# Altium project ui-v1.3.PrjPcb
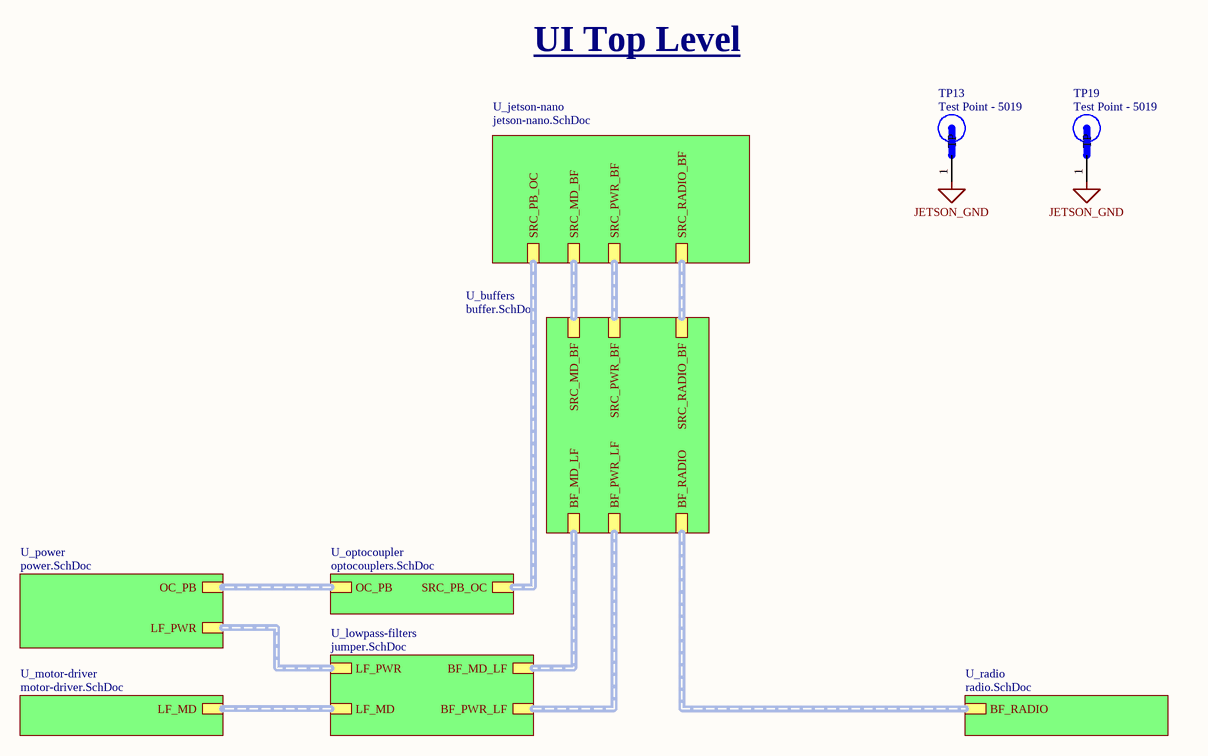
[diagram p0: ui-pcb.SchDoc]
8 sheets, 83 parts. Net scope: hierarchical (ports join the sheet entries above them; power ports are global).
Board file: ui_layout-v1.3.PcbDoc
Sheets:
  ui-pcb.SchDoc
    U_jetson-nano = jetson-nano.SchDoc
    U_lowpass-filters = jumper.SchDoc
    U_radio = radio.SchDoc
    U_motor-driver = motor-driver.SchDoc
    U_power = power.SchDoc
    U_buffers = buffer.SchDoc
    U_optocoupler = optocouplers.SchDoc

## Sheet ui-pcb.SchDoc
size A4; SheetNumber: 1; SheetTotal: 8

### Parts
TP13  Test Point - 5019  [TP380X203]
TP19  Test Point - 5019  [TP380X203]

### Sub-sheets
U_buffers = buffer.SchDoc: SRC_MD_BF (harness MD_SIGNALS), SRC_PWR_BF (harness PWR_SIGNALS), SRC_RADIO_BF (harness DS_SIGNALS), BF_MD_LF (harness MD_SIGNALS), BF_PWR_LF (harness PWR_SIGNALS), BF_RADIO (harness DS_SIGNALS)
U_jetson-nano = jetson-nano.SchDoc: SRC_RADIO_BF (harness DS_SIGNALS), SRC_PWR_BF (harness PWR_SIGNALS), SRC_MD_BF (harness MD_SIGNALS), SRC_PB_OC (harness PB_SIGNALS)
U_lowpass-filters = jumper.SchDoc: BF_PWR_LF (harness PWR_SIGNALS), LF_PWR (harness PWR_SIGNALS), BF_MD_LF (harness MD_SIGNALS), LF_MD (harness MD_SIGNALS)
U_motor-driver = motor-driver.SchDoc: LF_MD (harness MD_SIGNALS)
U_optocoupler = optocouplers.SchDoc: OC_PB (harness PB_SIGNALS), SRC_PB_OC (harness PB_SIGNALS)
U_power = power.SchDoc: LF_PWR (harness PWR_SIGNALS), OC_PB (harness PB_SIGNALS)
U_radio = radio.SchDoc: BF_RADIO (harness DS_SIGNALS)

### Nets
JETSON_GND: TP13.1(TP) TP19.1(TP)

### Buses and harness runs
harness sheet U_buffers/BF_MD_LF = sheet U_lowpass-filters/BF_MD_LF
harness sheet U_buffers/BF_PWR_LF = sheet U_lowpass-filters/BF_PWR_LF
harness sheet U_buffers/BF_RADIO = sheet U_radio/BF_RADIO
harness sheet U_buffers/SRC_MD_BF = sheet U_jetson-nano/SRC_MD_BF
harness sheet U_buffers/SRC_PWR_BF = sheet U_jetson-nano/SRC_PWR_BF
harness sheet U_buffers/SRC_RADIO_BF = sheet U_jetson-nano/SRC_RADIO_BF
harness sheet U_jetson-nano/SRC_PB_OC = sheet U_optocoupler/SRC_PB_OC
harness sheet U_lowpass-filters/LF_MD = sheet U_motor-driver/LF_MD
harness sheet U_lowpass-filters/LF_PWR = sheet U_power/LF_PWR
harness sheet U_optocoupler/OC_PB = sheet U_power/OC_PB

### Notes on the sheet
- UI Top Level

### Library data of the parts
TP13 TP19 = Test Point - 5019: PC Test Point, Miniature Phosphor Bronze, Silver Plating Surface Mount Mounting Type; MP: 5019; MF: Keystone Electronics; Value: *; Package: 2010 Keystone; Part Number: Test Point - 5019

## Sheet jetson-nano.SchDoc
size A3
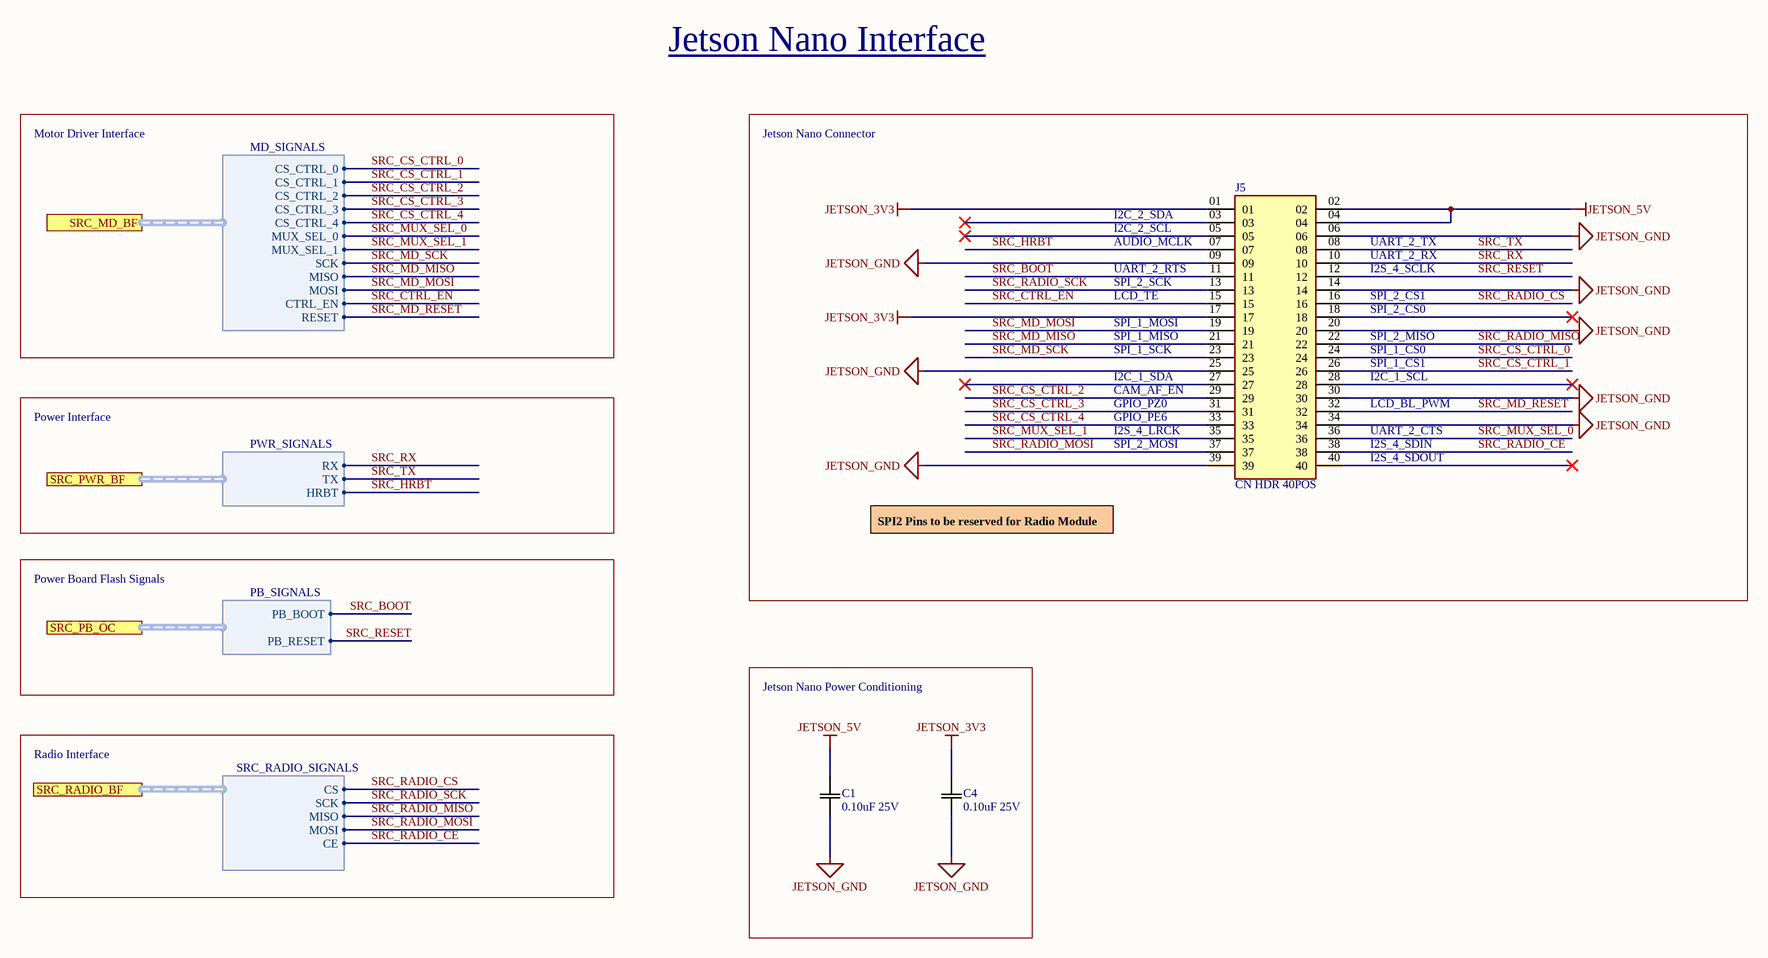
[diagram p1: jetson-nano.SchDoc]

### Parts
C1  0.10uF 25V  [0805]
C4  0.10uF 25V  [0805]
J5  CN HDR 40POS  [CN HDR 40POS 0.1 TH]

### Blocks framed on the sheet
Jetson Nano Power Conditioning: C1 C4

### Ports
SRC_MD_BF (harness MD_SIGNALS), SRC_PB_OC (harness PB_SIGNALS), SRC_PWR_BF (harness PWR_SIGNALS), SRC_RADIO_BF (harness SRC_RADIO_SIGNALS)

### Harnesses
PWR_SIGNALS: TX, RX, HRBT
MD_SIGNALS: CS_CTRL_0, MUX_SEL_1, SCK, MOSI, MISO, CS_CTRL_1, CS_CTRL_2, CS_CTRL_3, CS_CTRL_4, MUX_SEL_0, CTRL_EN, RESET
PB_SIGNALS: PB_BOOT, PB_RESET
SRC_RADIO_SIGNALS: SCK, MOSI, MISO, CS, CE

### Nets
JETSON_3V3: C4.2(C2) J5.01 J5.17
JETSON_5V: C1.2(C2) J5.02 J5.04
JETSON_GND: C1.1(C1) C4.1(C1) J5.06 J5.09 J5.14 J5.20 J5.25 J5.30 J5.34 J5.39
SRC_BOOT: J5.11 ; port SRC_PB_OC.PB_BOOT
SRC_CS_CTRL_0: J5.24 ; port SRC_MD_BF.CS_CTRL_0
SRC_CS_CTRL_1: J5.26 ; port SRC_MD_BF.CS_CTRL_1
SRC_CS_CTRL_2: J5.29 ; port SRC_MD_BF.CS_CTRL_2
SRC_CS_CTRL_3: J5.31 ; port SRC_MD_BF.CS_CTRL_3
SRC_CS_CTRL_4: J5.33 ; port SRC_MD_BF.CS_CTRL_4
SRC_CTRL_EN: J5.15 ; port SRC_MD_BF.CTRL_EN
SRC_HRBT: J5.07 ; port SRC_PWR_BF.HRBT
SRC_MD_MISO: J5.21 ; port SRC_MD_BF.MISO
SRC_MD_MOSI: J5.19 ; port SRC_MD_BF.MOSI
SRC_MD_RESET: J5.32 ; port SRC_MD_BF.RESET
SRC_MD_SCK: J5.23 ; port SRC_MD_BF.SCK
SRC_MUX_SEL_0: J5.36 ; port SRC_MD_BF.MUX_SEL_0
SRC_MUX_SEL_1: J5.35 ; port SRC_MD_BF.MUX_SEL_1
SRC_RADIO_CE: J5.38 ; port SRC_RADIO_BF.CE
SRC_RADIO_CS: J5.16 ; port SRC_RADIO_BF.CS
SRC_RADIO_MISO: J5.22 ; port SRC_RADIO_BF.MISO
SRC_RADIO_MOSI: J5.37 ; port SRC_RADIO_BF.MOSI
SRC_RADIO_SCK: J5.13 ; port SRC_RADIO_BF.SCK
SRC_RESET: J5.12 ; port SRC_PB_OC.PB_RESET
SRC_RX: J5.10 ; port SRC_PWR_BF.RX
SRC_TX: J5.08 ; port SRC_PWR_BF.TX

Not connected (* = marked no-connect by the designer): J5 03* 05* 18* 27* 28* 40*

### Notes on the sheet
- Jetson Nano Interface
- Motor Driver Interface
- Jetson Nano Connector
- AUDIO_MCLK
- UART_2_RTS
- I2C_2_SDA
- I2C_2_SCL
- I2S_4_SCLK
- UART_2_TX
- UART_2_RX
- LCD_TE
- SPI_2_SCK
- SPI_1_MOSI
- SPI_1_MISO
- SPI_2_CS1
- SPI_2_MISO
- SPI_2_CS0
- GPIO_PZ0
- CAM_AF_EN
- SPI_1_SCK
- I2C_1_SDA
- LCD_BL_PWM
- SPI_1_CS0
- SPI_1_CS1
- I2C_1_SCL
- Power Interface
- SPI_2_MOSI
- I2S_4_LRCK
- GPIO_PE6
- I2S_4_SDIN
- UART_2_CTS
- I2S_4_SDOUT
- SPI2 Pins to be reserved for Radio Module
- Power Board Flash Signals
- Radio Interface

### Library data of the parts
C1 C4 = CAP 0.10uF 25V: CAP CER 0.10UF 25V X7R 0805; Value: 0.1uF; Tolerance: 10%; Temperature Coefficient: X7R; Rating: 25V; Part Number: CAP 0.10uF 25V; Operating Temperature: -55°C ~ 125°C
J5 = CN HDR 40POS: 40 Position Header Connector; Part Number: CN HDR 40POS; Supplier 1: Digi-Key; Supplier Part Number 1: S6104-ND; Supplier URL 1: https://www.digikey.ca/en/products/detail/sullins-connector-solutions/PPTC202LFBN-RC/807240?s=N4IgTCBcDaIMoDYCMAGALAWgHIBEQF0BfIA; Pin Count: 40

## Sheet jumper.SchDoc
size A3; SheetNumber: 1; SheetTotal: 6
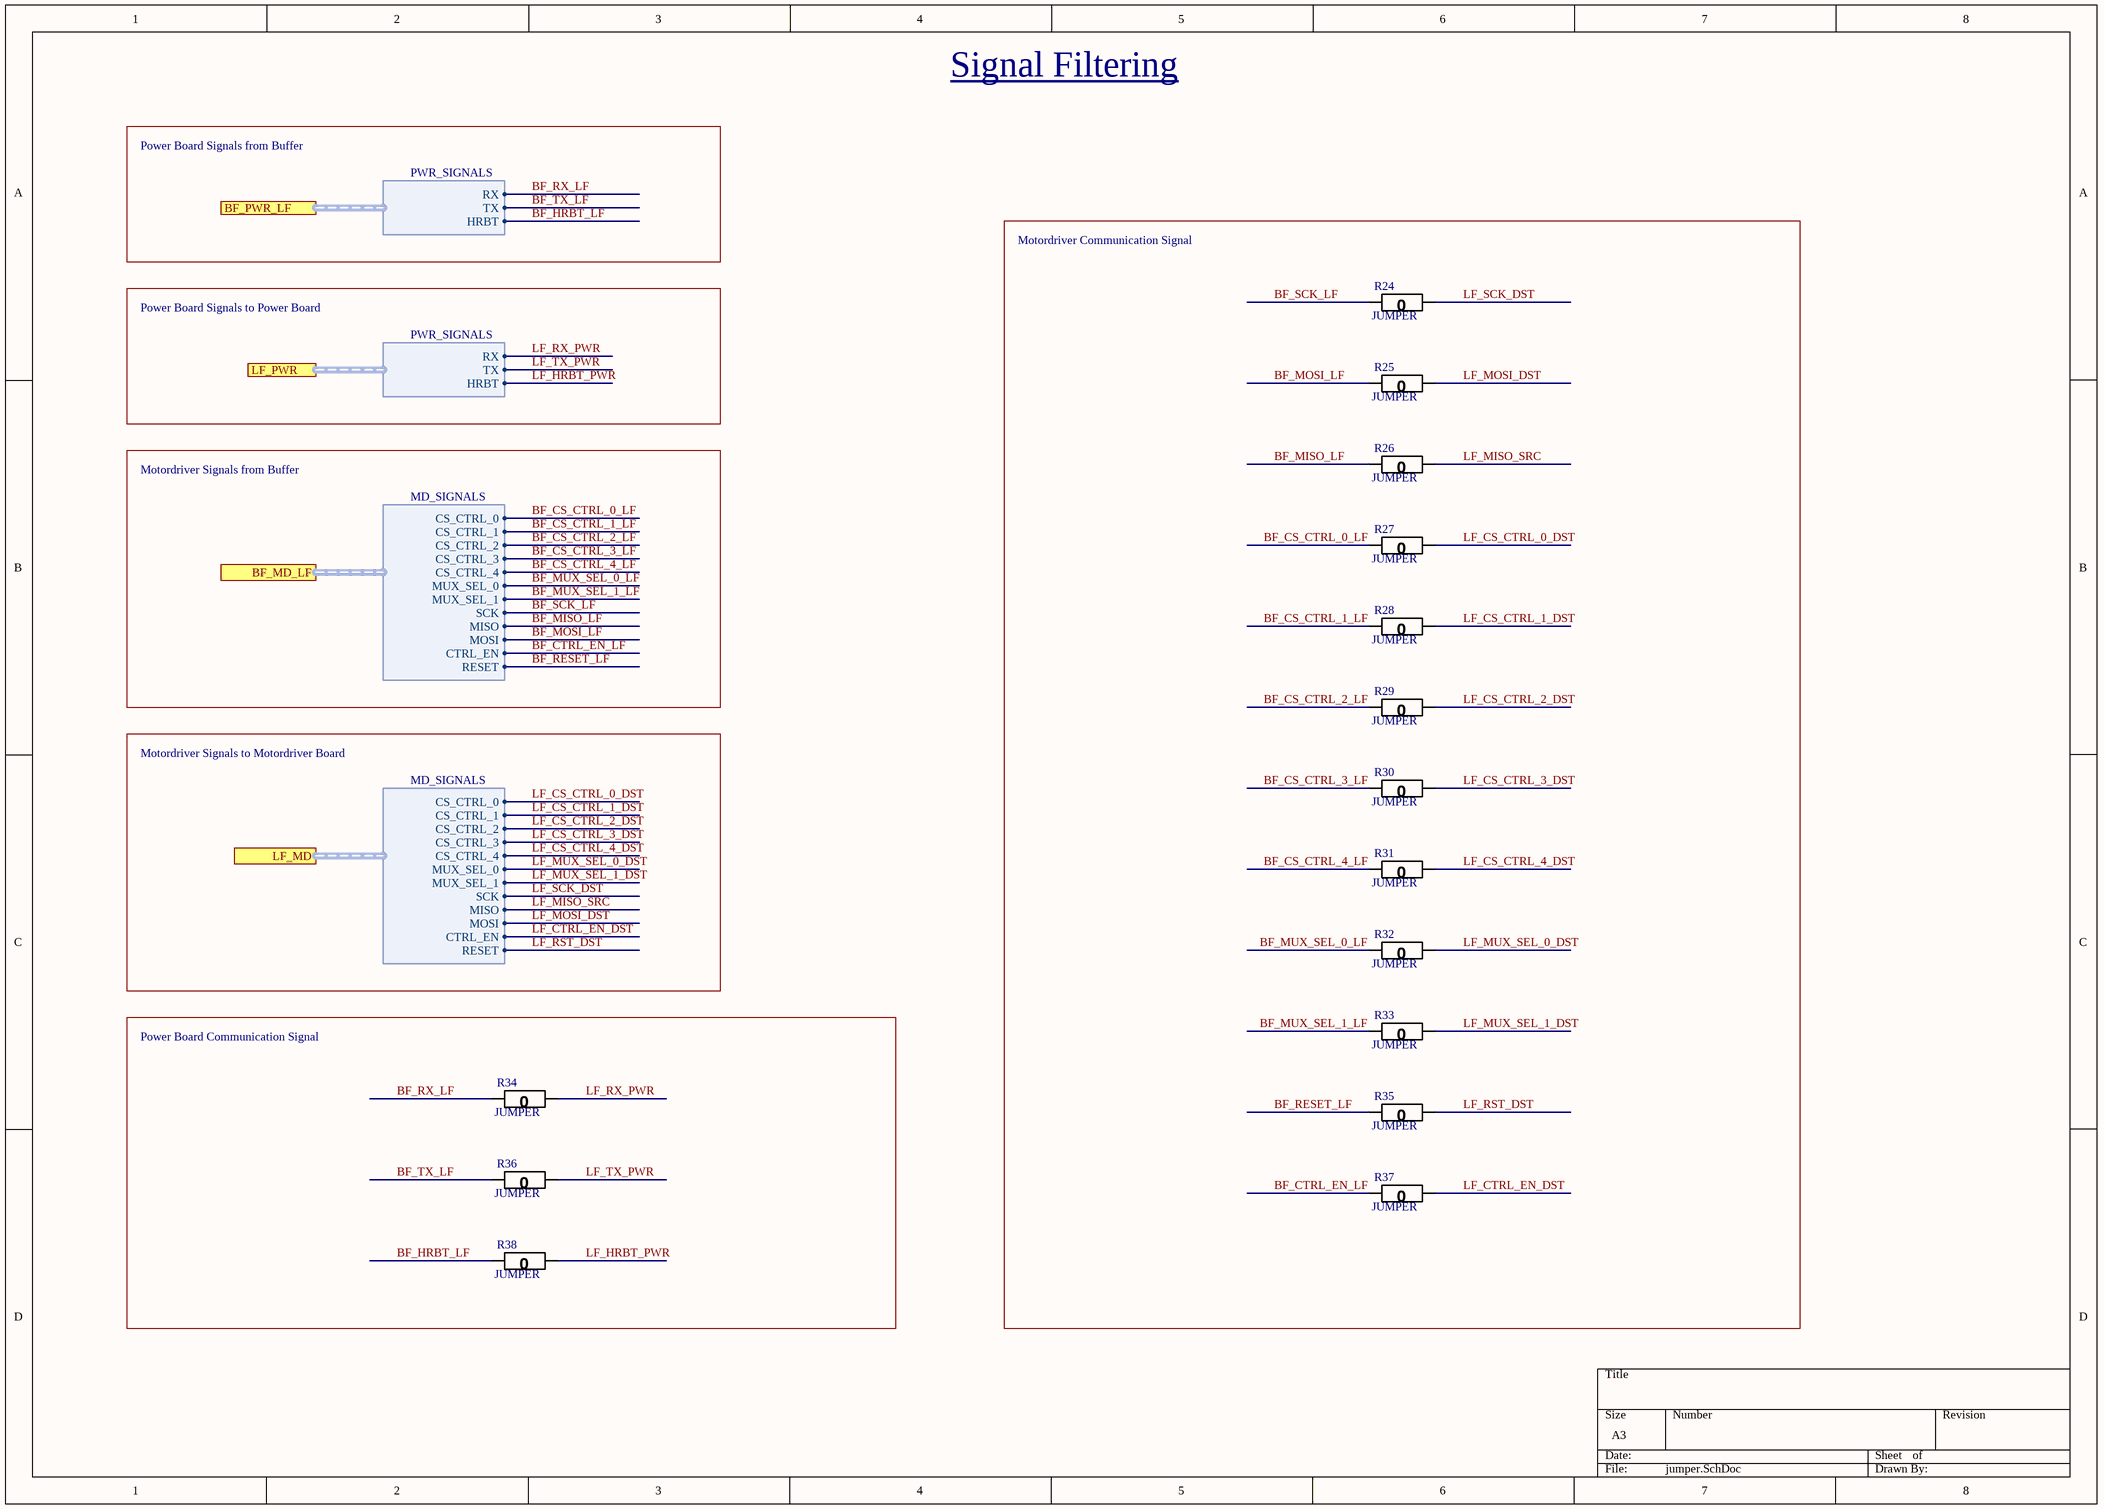
[diagram p2: jumper.SchDoc]

### Parts
R24  JUMPER  [0603]
R25  JUMPER  [0603]
R26  JUMPER  [0603]
R27  JUMPER  [0603]
R28  JUMPER  [0603]
R29  JUMPER  [0603]
R30  JUMPER  [0603]
R31  JUMPER  [0603]
R32  JUMPER  [0603]
R33  JUMPER  [0603]
R34  JUMPER  [0603]
R35  JUMPER  [0603]
R36  JUMPER  [0603]
R37  JUMPER  [0603]
R38  JUMPER  [0603]

### Blocks framed on the sheet
Motordriver Communication Signal: R24-R33 R35 R37
Power Board Communication Signal: R34 R36 R38

### Ports
BF_MD_LF (harness MD_SIGNALS), BF_PWR_LF (harness PWR_SIGNALS), LF_MD (harness MD_SIGNALS), LF_PWR (harness PWR_SIGNALS)

### Harnesses
PWR_SIGNALS: TX, RX, HRBT
MD_SIGNALS: CS_CTRL_0, MUX_SEL_1, SCK, MOSI, MISO, CS_CTRL_1, CS_CTRL_2, CS_CTRL_3, CS_CTRL_4, MUX_SEL_0, CTRL_EN, RESET

### Nets
BF_CS_CTRL_0_LF: R27.2(R2) ; port BF_MD_LF.CS_CTRL_0  [project net BF_CS_CTRL_0]
BF_CS_CTRL_1_LF: R28.2(R2) ; port BF_MD_LF.CS_CTRL_1  [project net BF_CS_CTRL_1]
BF_CS_CTRL_2_LF: R29.2(R2) ; port BF_MD_LF.CS_CTRL_2  [project net BF_CS_CTRL_2]
BF_CS_CTRL_3_LF: R30.2(R2) ; port BF_MD_LF.CS_CTRL_3  [project net BF_CS_CTRL_3]
BF_CS_CTRL_4_LF: R31.2(R2) ; port BF_MD_LF.CS_CTRL_4  [project net BF_CS_CTRL_4]
BF_CTRL_EN_LF: R37.2(R2) ; port BF_MD_LF.CTRL_EN  [project net BF_CTRL_EN]
BF_HRBT_LF: R38.2(R2) ; port BF_PWR_LF.HRBT  [project net BF_HRBT]
BF_MISO_LF: R26.2(R2) ; port BF_MD_LF.MISO  [project net BF_MISO]
BF_MOSI_LF: R25.2(R2) ; port BF_MD_LF.MOSI  [project net BF_MOSI]
BF_MUX_SEL_0_LF: R32.2(R2) ; port BF_MD_LF.MUX_SEL_0  [project net BF_MUX_SEL_0]
BF_MUX_SEL_1_LF: R33.2(R2) ; port BF_MD_LF.MUX_SEL_1  [project net BF_MUX_SEL_1]
BF_RESET_LF: R35.2(R2) ; port BF_MD_LF.RESET  [project net BF_RESET]
BF_RX_LF: R34.2(R2) ; port BF_PWR_LF.RX  [project net BF_RX]
BF_SCK_LF: R24.2(R2) ; port BF_MD_LF.SCK  [project net BF_SCK]
BF_TX_LF: R36.2(R2) ; port BF_PWR_LF.TX  [project net BF_TX]
LF_CS_CTRL_0_DST: R27.1(R1) ; port LF_MD.CS_CTRL_0  [project net CS_CTRL_0]
LF_CS_CTRL_1_DST: R28.1(R1) ; port LF_MD.CS_CTRL_1  [project net CS_CTRL_1]
LF_CS_CTRL_2_DST: R29.1(R1) ; port LF_MD.CS_CTRL_2  [project net CS_CTRL_2]
LF_CS_CTRL_3_DST: R30.1(R1) ; port LF_MD.CS_CTRL_3  [project net CS_CTRL_3]
LF_CS_CTRL_4_DST: R31.1(R1) ; port LF_MD.CS_CTRL_4  [project net CS_CTRL_4]
LF_CTRL_EN_DST: R37.1(R1) ; port LF_MD.CTRL_EN  [project net CTRL_EN]
LF_HRBT_PWR: R38.1(R1) ; port LF_PWR.HRBT  [project net HRBT]
LF_MISO_SRC: R26.1(R1) ; port LF_MD.MISO
LF_MOSI_DST: R25.1(R1) ; port LF_MD.MOSI
LF_MUX_SEL_0_DST: R32.1(R1) ; port LF_MD.MUX_SEL_0
LF_MUX_SEL_1_DST: R33.1(R1) ; port LF_MD.MUX_SEL_1
LF_RST_DST: R35.1(R1) ; port LF_MD.RESET
LF_RX_PWR: R34.1(R1) ; port LF_PWR.RX
LF_SCK_DST: R24.1(R1) ; port LF_MD.SCK
LF_TX_PWR: R36.1(R1) ; port LF_PWR.TX

### Notes on the sheet
- Signal Filtering
- Power Board Signals from Buffer
- Power Board Signals to Power Board
- Motordriver Signals from Buffer
- Motordriver Signals to Motordriver Board

### Library data of the parts
R24-R38 = RES 0 JUMPER: RES SMD 0 OHM JUMPER GENERIC 0603; Manufacturer Part Number 1: RK73Z1JTTD; Value: 0; Package: 0805; Part Number: RES 0 JUMPER; Tolerance: N/A; Supplier 1: Digi-Key; Supplier Part Number 1: 2019-RK73Z1JTTDCT-ND; Supplier URL 1: https://www.digikey.ca/en/products/detail/koa-speer-electronics-inc/RK73Z1JTTD/9845478

## Sheet radio.SchDoc
size A4; SheetNumber: 8; SheetTotal: 8
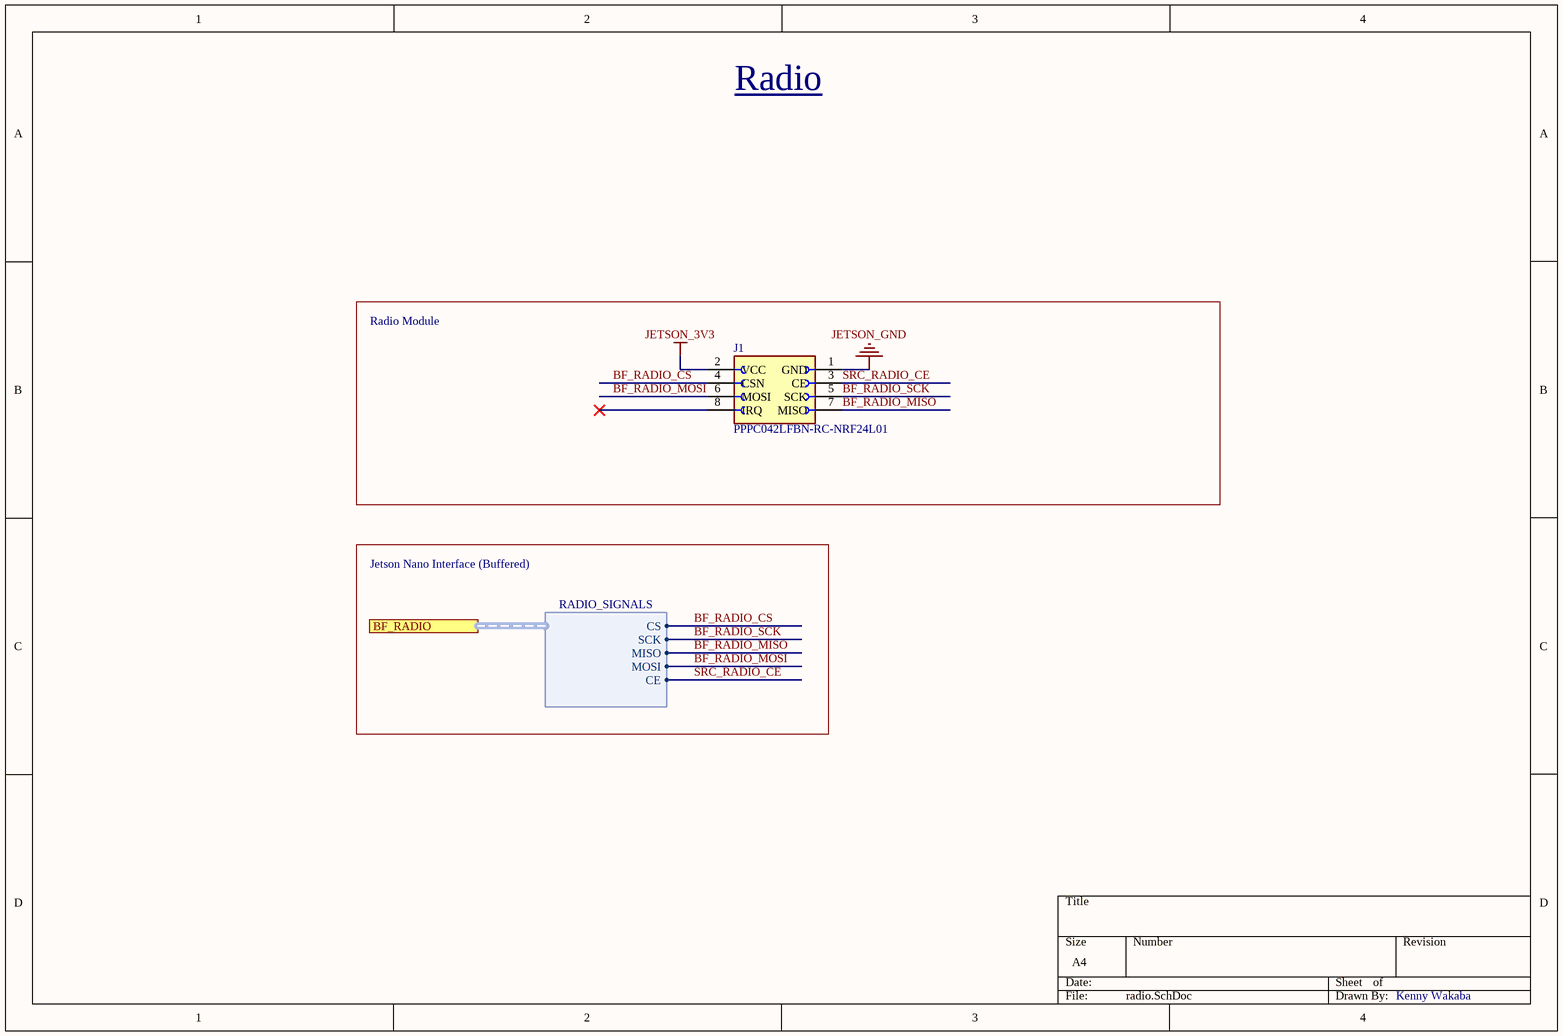
[diagram p3: radio.SchDoc]

### Parts
J1  PPPC042LFBN-RC-NRF24L01  [PPPC042LFBN-RC-NRF24L01]

### Blocks framed on the sheet
Radio Module: J1

### Ports
BF_RADIO (harness RADIO_SIGNALS)

### Harnesses
RADIO_SIGNALS: SCK, MOSI, MISO, CS, CE

### Nets
JETSON_3V3: J1.2(VCC)
JETSON_GND: J1.1(GND)
BF_RADIO_CS: J1.4(CSN) ; port BF_RADIO.CS
BF_RADIO_MISO: J1.7(MISO) ; port BF_RADIO.MISO
BF_RADIO_MOSI: J1.6(MOSI) ; port BF_RADIO.MOSI
BF_RADIO_SCK: J1.5(SCK) ; port BF_RADIO.SCK
SRC_RADIO_CE: J1.3(CE) ; port BF_RADIO.CE  [project net BF_RADIO_CE]

Not connected (* = marked no-connect by the designer): J1 8(IRQ)*

### Notes on the sheet
- Radio
- Jetson Nano Interface (Buffered)
- Kenny Wakaba

### Library data of the parts
J1 = CN PPPC042LFBN-RC-NRF24L01: 8 Position Header Connector 0.100 (2.54mm) Through Hole Gold; MF: Sullins Connector Solutions; SnapEDA_Link: https://www.snapeda.com/parts/PPPC042LFBN-RC/Sullins+Connector+Solutions/view-part/?ref=snap; Package: None; Purchase-URL: https://pricing.snapeda.com/search/part/PPPC042LFBN-RC/?ref=eda; Price: None; Value: *; Check_prices: https://www.snapeda.com/parts/PPPC042LFBN-RC/Sullins+Connector+Solutions/view-part/?ref=eda; MP: PPPC042LFBN-RC; Availability: In Stock; Part Number: CN PPPC042LFBN-RC-NRF24L01; Manufacturer Part Number 1: PPPC042LFBN-RC; Supplier 1: Digi-Key; Supplier Part Number 1: S7107-ND; Supplier URL 1: https://www.digikey.ca/en/products/detail/sullins-connector-solutions/PPPC042LFBN-RC/810244?utm_adgroup=Rectangular%20Connectors%20-%20Headers%2C%20Receptacles%2C%20Female%20Sockets&utm_source=google&utm_medium=cpc&utm_campaign=Shopping_Product_Connectors; Pin Count: 8

## Sheet motor-driver.SchDoc
size A
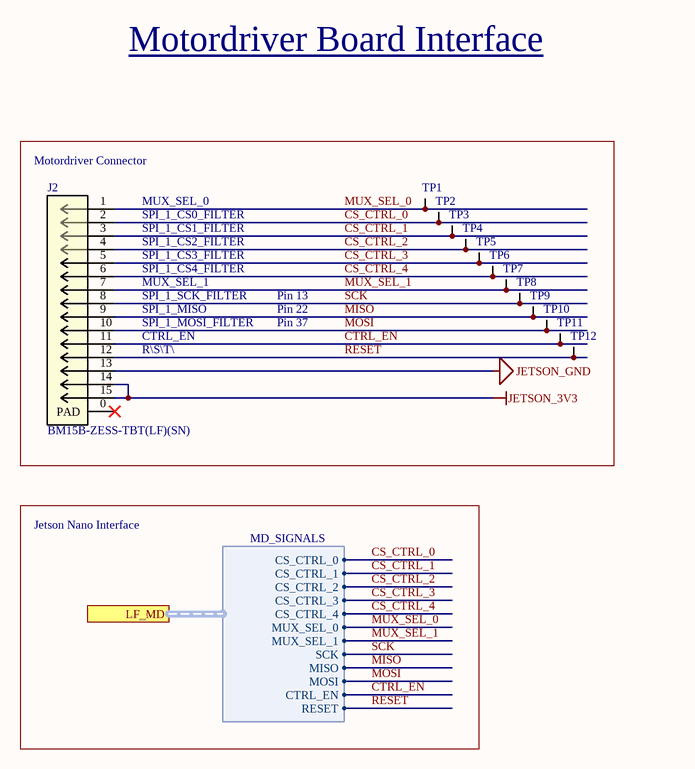
[diagram p4: motor-driver.SchDoc]

### Parts
J2  BM15B-ZESS-TBT(LF)(SN)  [JST ZE SMT 15POS]
TP1  Test Point (Via)  [TP]  (value not drawn)  (no BOM)
TP2  Test Point (Via)  [TP]  (value not drawn)  (no BOM)
TP3  Test Point (Via)  [TP]  (value not drawn)  (no BOM)
TP4  Test Point (Via)  [TP]  (value not drawn)  (no BOM)
TP5  Test Point (Via)  [TP]  (value not drawn)  (no BOM)
TP6  Test Point (Via)  [TP]  (value not drawn)  (no BOM)
TP7  Test Point (Via)  [TP]  (value not drawn)  (no BOM)
TP8  Test Point (Via)  [TP]  (value not drawn)  (no BOM)
TP9  Test Point (Via)  [TP]  (value not drawn)  (no BOM)
TP10  Test Point (Via)  [TP]  (value not drawn)  (no BOM)
TP11  Test Point (Via)  [TP]  (value not drawn)  (no BOM)
TP12  Test Point (Via)  [TP]  (value not drawn)  (no BOM)

### Ports
LF_MD (harness MD_SIGNALS)

### Harnesses
MD_SIGNALS: CS_CTRL_0, MUX_SEL_1, SCK, MOSI, MISO, CS_CTRL_1, CS_CTRL_2, CS_CTRL_3, CS_CTRL_4, MUX_SEL_0, CTRL_EN, RESET

### Nets
JETSON_3V3: J2.14 J2.15
JETSON_GND: J2.13
CS_CTRL_0: J2.2 TP2.1 ; port LF_MD.CS_CTRL_0
CS_CTRL_1: J2.3 TP3.1 ; port LF_MD.CS_CTRL_1
CS_CTRL_2: J2.4 TP4.1 ; port LF_MD.CS_CTRL_2
CS_CTRL_3: J2.5 TP5.1 ; port LF_MD.CS_CTRL_3
CS_CTRL_4: J2.6 TP6.1 ; port LF_MD.CS_CTRL_4
CTRL_EN: J2.11 TP11.1 ; port LF_MD.CTRL_EN
MISO: J2.9 TP9.1 ; port LF_MD.MISO  [project net LF_MISO_SRC]
MOSI: J2.10 TP10.1 ; port LF_MD.MOSI  [project net LF_MOSI_DST]
MUX_SEL_0: J2.1 TP1.1 ; port LF_MD.MUX_SEL_0  [project net LF_MUX_SEL_0_DST]
MUX_SEL_1: J2.7 TP7.1 ; port LF_MD.MUX_SEL_1  [project net LF_MUX_SEL_1_DST]
RESET: J2.12 TP12.1 ; port LF_MD.RESET  [project net LF_RST_DST]
SCK: J2.8 TP8.1 ; port LF_MD.SCK  [project net LF_SCK_DST]

Not connected (* = marked no-connect by the designer): J2 0(PAD)*

### Notes on the sheet
- Motordriver Board Interface
- (near J2) Motordriver Connector
- MUX_SEL_0
- SPI_1_CS0_FILTER
- SPI_1_CS1_FILTER
- SPI_1_CS2_FILTER
- SPI_1_CS3_FILTER
- SPI_1_CS4_FILTER
- CTRL_EN
- SPI_1_SCK_FILTER
- SPI_1_MISO
- SPI_1_MOSI_FILTER
- MUX_SEL_1
- Pin 37
- Pin 22
- Pin 13
- R\S\T\
- Jetson Nano Interface

### Library data of the parts
J2 = CN 15POS JST ZE SMT: CONN HEADER VERT SMD 15POS ZE; Supplier 1: Digi-Key; Supplier Part Number 1: 455-4211-1-ND; Part Number: CN 15POS JST ZE SMT; Manufacturer Part Number 1: BM15B-ZESS-TBT(LF)(SN); Supplier URL 1: https://www.digikey.ca/en/products/detail/jst-sales-america-inc/BM15B-ZESS-TBT-LF-SN/1886999?s=N4IgTCBcDaIEIFkCMBWOBaAWgUQMq-QBU5CAKAGQDEBKU3AOWpAF0BfIA; Pin Count: 15
TP1-TP12 = Test Point (Via): Part Number: Test Point (Via)

## Sheet power.SchDoc
size A4; SheetNumber: 3; SheetTotal: 4
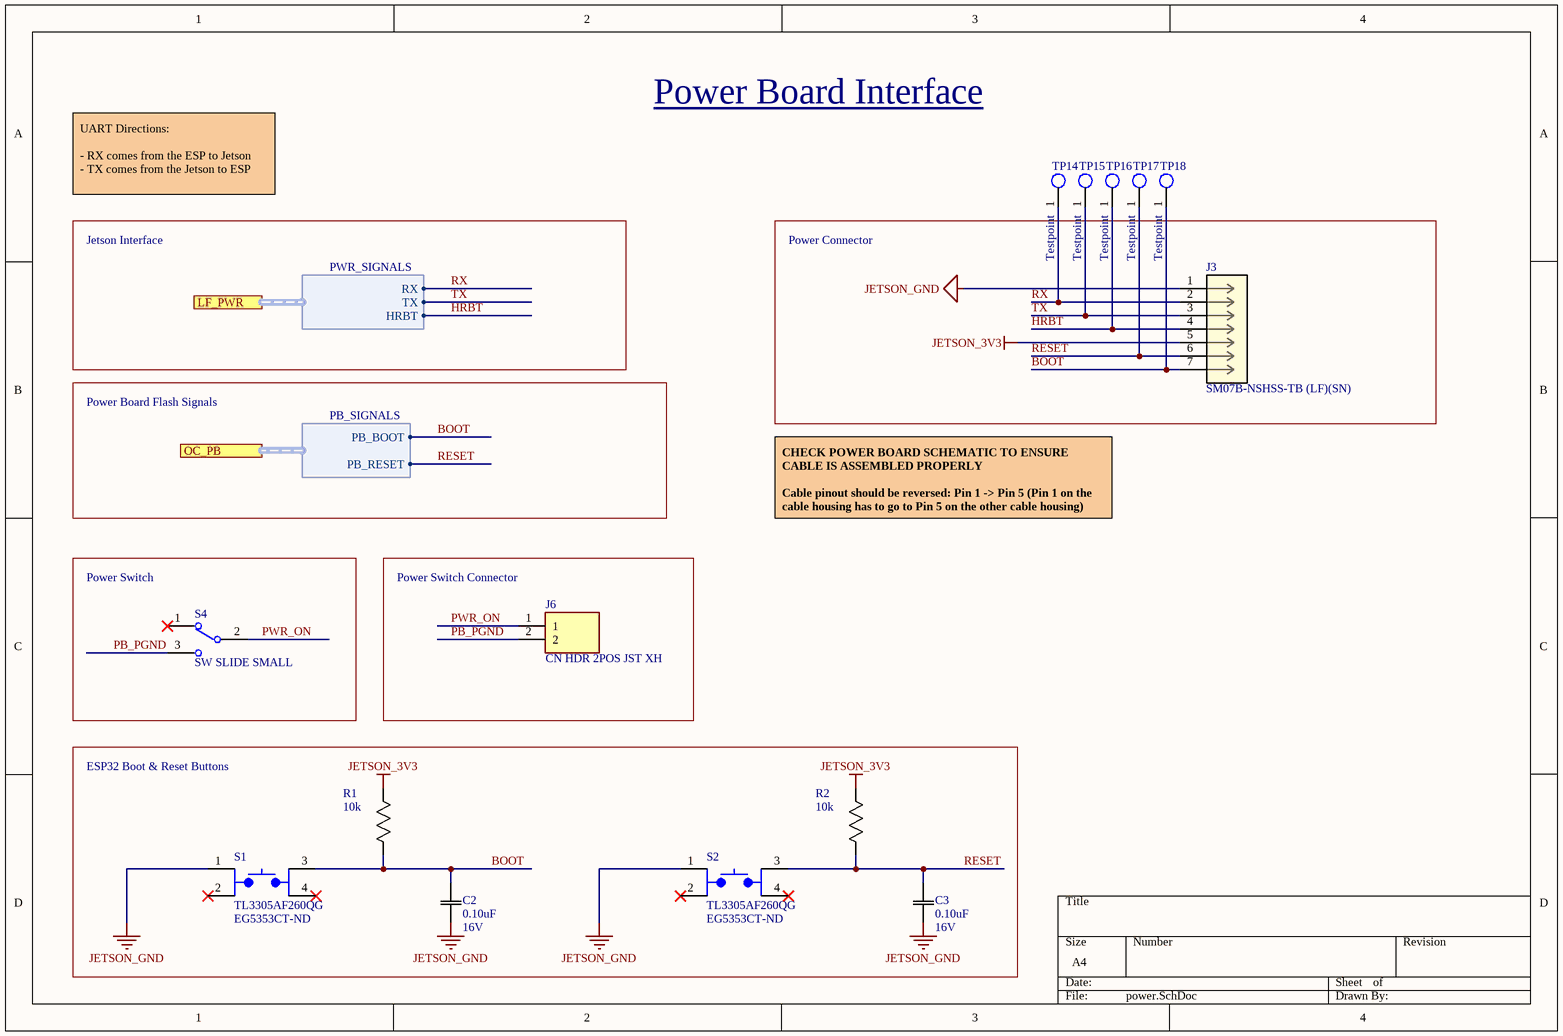
[diagram p5: power.SchDoc]

### Parts
C2  Rating: 16V  [0603]  (hidden comment: 0.10uF)
C3  Rating: 16V  [0603]  (hidden comment: 0.10uF)
J3  SM07B-NSHSS-TB (LF)(SN)  [JST_SM07B-NSHSS-TB_(LF)(SN)]
J6  CN HDR 2POS JST XH  [JST_B2B-XH-A(LF)(SN)]
R1  10k  [0603]
R2  10k  [0603]
S1  TL3305AF260QG  Supplier Part Number 1: EG5353CT-ND  [SW_TL3305AF260QG]
S2  TL3305AF260QG  Supplier Part Number 1: EG5353CT-ND  [SW_TL3305AF260QG]
S4  SW SLIDE SMALL  [SW SLIDE SMALL]
TP14  Testpoint  [TP_1mm]
TP15  Testpoint  [TP_1mm]
TP16  Testpoint  [TP_1mm]
TP17  Testpoint  [TP_1mm]
TP18  Testpoint  [TP_1mm]

### Blocks framed on the sheet
Power Connector: J3
Power Switch: S4
Power Switch Connector: J6
ESP32 Boot & Reset Buttons: C2 C3 R1 R2 S1 S2

### Ports
LF_PWR (harness PWR_SIGNALS), OC_PB (harness PB_SIGNALS)

### Harnesses
PWR_SIGNALS: TX, RX, HRBT
PB_SIGNALS: PB_BOOT, PB_RESET

### Nets
JETSON_3V3: J3.5 R1.1(R1) R2.1(R1)
JETSON_GND: C2.1(C1) C3.1(C1) J3.1 S1.1 S2.1
BOOT: C2.2(C2) J3.7 R1.2(R2) S1.3 TP18.1(TP) ; port OC_PB.PB_BOOT
HRBT: J3.4 TP16.1(TP) ; port LF_PWR.HRBT
PB_PGND: J6.2 S4.3
PWR_ON: J6.1 S4.2
RESET: C3.2(C2) J3.6 R2.2(R2) S2.3 TP17.1(TP) ; port OC_PB.PB_RESET  [project net PB_RESET]
RX: J3.2 TP14.1(TP) ; port LF_PWR.RX  [project net LF_RX_PWR]
TX: J3.3 TP15.1(TP) ; port LF_PWR.TX  [project net LF_TX_PWR]

Not connected (* = marked no-connect by the designer): S1 2* 4*; S2 2* 4*; S4 1*

### Notes on the sheet
- Power Board Interface
- UART Directions:
  - RX comes from the ESP to Jetson
  - TX comes from the Jetson to ESP
- Jetson Interface
- Power Board Flash Signals
- CHECK POWER BOARD SCHEMATIC TO ENSURE CABLE IS ASSEMBLED PROPERLY
  Cable pinout should be reversed: Pin 1 -> Pin 5 (Pin 1 on the cable housing has to go to Pin 5 on the other cable housing)

### Library data of the parts
C2 C3 = CAP 0.10uF 16V: CAP CER 0.10UF 16V X5R 0603; Tolerance: 10%; Package: 0603/0805; Temperature Coefficient: X5R; Operating Temperature: -55°C ~ 85°C; Value: 0.10uF; Part Number: CAP 0.10uF 16V
J3 = CN 7POS JST NSH SMT RA: Connector Header Surface Mount, Right Angle 7 position 0.039" (1.00mm); MP: SM12B-NSHSS-TB (LF)(SN); MF: JST Sales America Inc.; Package: None; Check_prices: https://www.snapeda.com/parts/SM12B-NSHSS-TB%20(LF)(SN)/JST%20Sales%20America%20Inc./view-part/5255521/?ref=eda; Value: *; Availability: Unavailable; Price: None; SnapEDA_Link: https://www.snapeda.com/parts/SM12B-NSHSS-TB%20(LF)(SN)/JST%20Sales%20America%20Inc./view-part/5255521/?ref=snap; Supplier 1: Digi-Key; Supplier 2: Digi-Key; Supplier 3: Digi-Key; Supplier 4: Digi-Key; Supplier Part Number 1: 455-2771-1-ND; Supplier Part Number 2: 455-2771-1-ND; Supplier Part Number 3: 455-2771-6-ND; Supplier Part Number 4: 455-2771-2-ND; Part Number: CN 7POS JST NSH SMT RA; Supplier URL 1: https://www.digikey.ca/en/products/detail/jst-sales-america-inc/SM07B-NSHSS-TB-LF-SN/3313637; Pin Count: 7
J6 = CN HDR 2POS JST XH: Connector Header Through Hole 2 position 0.098 _2.50mm_ / JST XH; MP: B2B-XH-A_LF__SN_; MF: JST Sales; Price: None; Package: None; Value: *; SnapEDA_Link: https://www.snapeda.com/parts/B2B-XH-A%28LF%29%28SN%29/JST%20Sales%20America%20Inc./view-part/492310/?ref=snap; Part Number: CN HDR 2POS JST XH; Pin Count: 2
R1 R2 = RES 10k 1/8W - 5%: RES SMD 10K OHM 5% 1/8W 0805; Power (Watts): 0.125W; Package: 0805; Value: 10k; Tolerance: 5%; Part Number: RES 10k 1/8W - 5%
S1 S2 = SW PUSH SMD: Tactile Switch SPST-NO Top Actuated Surface Mount; MF: E-Switch; Price: None; Value: *; MP: TL3305AF260QG; Package: LQFP-48 E-Switch; SnapEDA_Link: https://www.snapeda.com/parts/TL3305AF260QG/E-Switch/view-part/479903/?ref=snap; Availability: Unavailable; Supplier 1: Digi-key; Part Number: SW PUSH SMD; Manufacturer Part Number 1: TL3305AF260QG; Supplier URL 1: https://www.digikey.com/en/products/detail/e-switch/TL3305AF260QG/5816184
S4 = SW SLIDE SMALL: Slide Switch SPDT Surface Mount, Right Angle; Manufacturer Part Number 1: JS102011SAQN SPDT; MF: C&K; MP: JS102011SAQN; Availability: Unavailable; Price: None; SnapEDA_Link: https://www.snapeda.com/parts/JS102011SAQN/C%26K/view-part/214325/?ref=snap; Value: *; Package: None; Part Number: SW SLIDE SMALL; Supplier 1: Digi-key; Supplier Part Number 1: JS102011SAQN SPDT; Supplier URL 1: https://www.digikey.ca/en/products/detail/c-k/JS102011SAQN/1640095
TP14-TP18 = TP_1MM: Part Number: TP_1MM

## Sheet buffer.SchDoc
size A3
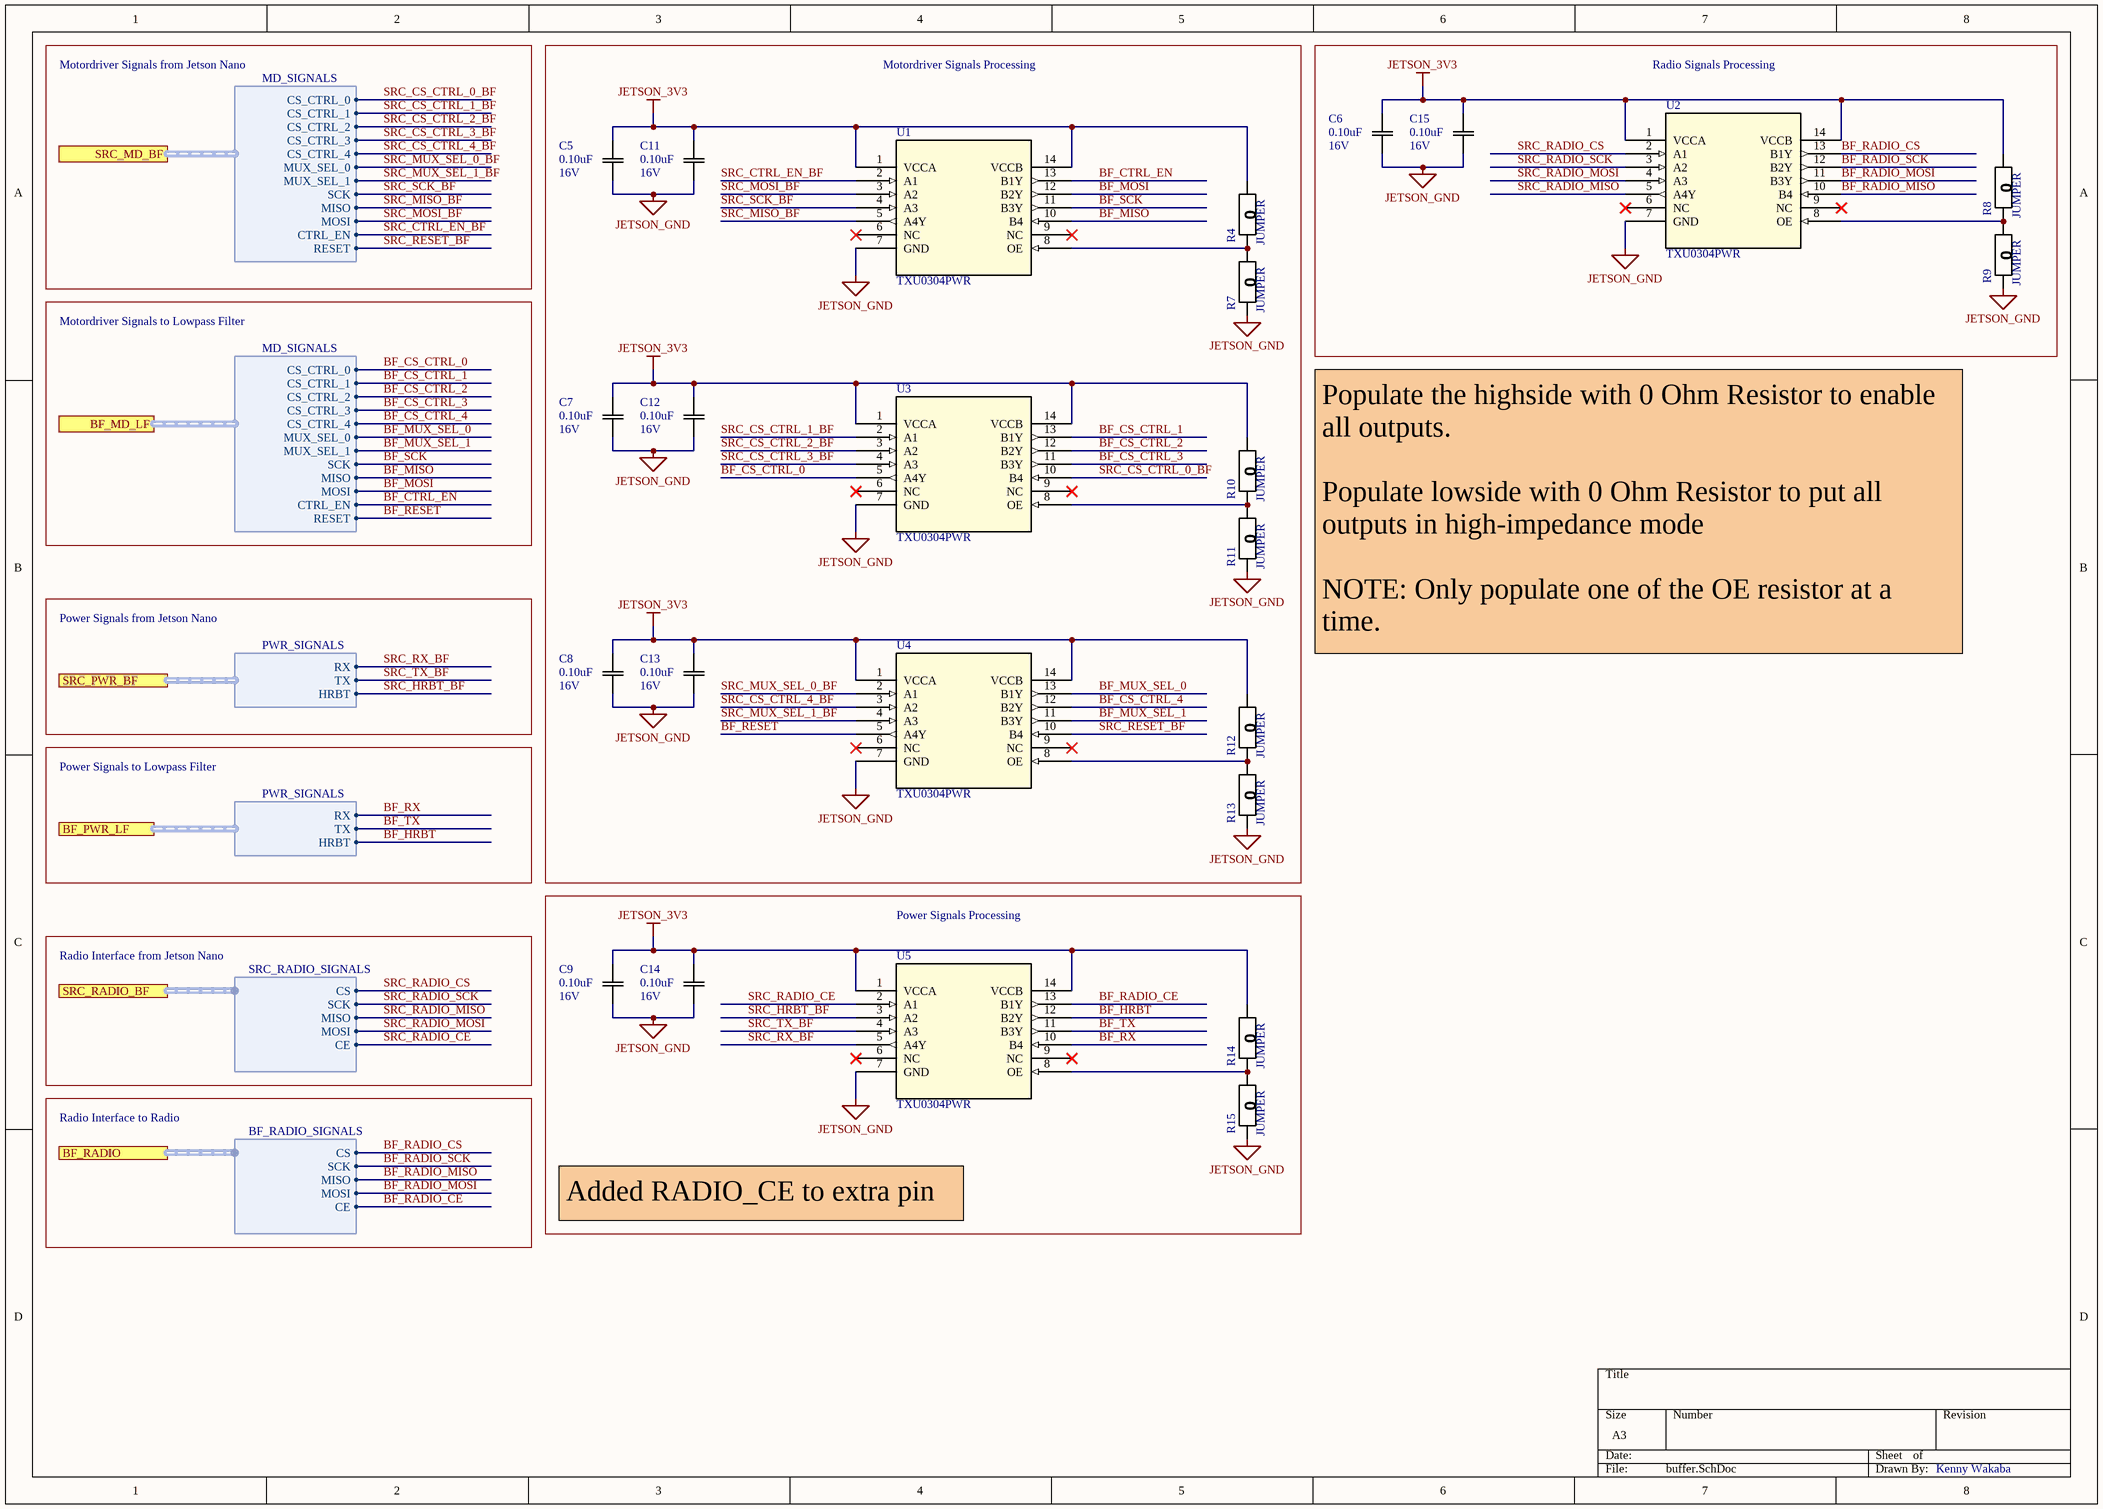
[diagram p6: buffer.SchDoc]

### Parts
C5  Rating: 16V  [0603]  (hidden comment: 0.10uF)
C6  Rating: 16V  [0603]  (hidden comment: 0.10uF)
C7  Rating: 16V  [0603]  (hidden comment: 0.10uF)
C8  Rating: 16V  [0603]  (hidden comment: 0.10uF)
C9  Rating: 16V  [0603]  (hidden comment: 0.10uF)
C11  Rating: 16V  [0603]  (hidden comment: 0.10uF)
C12  Rating: 16V  [0603]  (hidden comment: 0.10uF)
C13  Rating: 16V  [0603]  (hidden comment: 0.10uF)
C14  Rating: 16V  [0603]  (hidden comment: 0.10uF)
C15  Rating: 16V  [0603]  (hidden comment: 0.10uF)
R4  JUMPER  [0603]
R7  JUMPER  [0603]
R8  JUMPER  [0603]
R9  JUMPER  [0603]
R10  JUMPER  [0603]
R11  JUMPER  [0603]
R12  JUMPER  [0603]
R13  JUMPER  [0603]
R14  JUMPER  [0603]
R15  JUMPER  [0603]
U1  TXU0304PWR  [14-TSSOP]
U2  TXU0304PWR  [14-TSSOP]
U3  TXU0304PWR  [14-TSSOP]
U4  TXU0304PWR  [14-TSSOP]
U5  TXU0304PWR  [14-TSSOP]

### Blocks framed on the sheet
Motordriver Signals Processing: C5 C7 C8 C11-C13 R4 R7 R10-R13 U1 U3 U4
Radio Signals Processing: C6 C15 R8 R9 U2
Power Signals Processing: C9 C14 R14 R15 U5

### Ports
BF_MD_LF (harness MD_SIGNALS), BF_PWR_LF (harness PWR_SIGNALS), BF_RADIO (harness BF_RADIO_SIGNALS), SRC_MD_BF (harness MD_SIGNALS), SRC_PWR_BF (harness PWR_SIGNALS), SRC_RADIO_BF (harness SRC_RADIO_SIGNALS)

### Harnesses
PWR_SIGNALS: TX, RX, HRBT
MD_SIGNALS: CS_CTRL_0, MUX_SEL_1, SCK, MOSI, MISO, CS_CTRL_1, CS_CTRL_2, CS_CTRL_3, CS_CTRL_4, MUX_SEL_0, CTRL_EN, RESET
SRC_RADIO_SIGNALS: SCK, MOSI, MISO, CS, CE
BF_RADIO_SIGNALS: SCK, MOSI, MISO, CS, CE

### Nets
JETSON_3V3: C5.1(C1) C6.1(C1) C7.1(C1) C8.1(C1) C9.1(C1) C11.1(C1) C12.1(C1) C13.1(C1) C14.1(C1) C15.1(C1) R4.1(R1) R8.1(R1) R10.1(R1) R12.1(R1) R14.1(R1) U1.1(VCCA) U1.14(VCCB) U2.1(VCCA) U2.14(VCCB) U3.1(VCCA) U3.14(VCCB) U4.1(VCCA) U4.14(VCCB) U5.1(VCCA) U5.14(VCCB)
JETSON_GND: C5.2(C2) C6.2(C2) C7.2(C2) C8.2(C2) C9.2(C2) C11.2(C2) C12.2(C2) C13.2(C2) C14.2(C2) C15.2(C2) R7.2(R2) R9.2(R2) R11.2(R2) R13.2(R2) R15.2(R2) U1.7(GND) U2.7(GND) U3.7(GND) U4.7(GND) U5.7(GND)
BF_CS_CTRL_0: U3.5(A4Y) ; port BF_MD_LF.CS_CTRL_0
BF_CS_CTRL_1: U3.13(B1Y) ; port BF_MD_LF.CS_CTRL_1
BF_CS_CTRL_2: U3.12(B2Y) ; port BF_MD_LF.CS_CTRL_2
BF_CS_CTRL_3: U3.11(B3Y) ; port BF_MD_LF.CS_CTRL_3
BF_CS_CTRL_4: U4.12(B2Y) ; port BF_MD_LF.CS_CTRL_4
BF_CTRL_EN: U1.13(B1Y) ; port BF_MD_LF.CTRL_EN
BF_HRBT: U5.12(B2Y) ; port BF_PWR_LF.HRBT
BF_MISO: U1.10(B4) ; port BF_MD_LF.MISO
BF_MOSI: U1.12(B2Y) ; port BF_MD_LF.MOSI
BF_MUX_SEL_0: U4.13(B1Y) ; port BF_MD_LF.MUX_SEL_0
BF_MUX_SEL_1: U4.11(B3Y) ; port BF_MD_LF.MUX_SEL_1
BF_RADIO_CE: U5.13(B1Y) ; port BF_RADIO.CE
BF_RADIO_CS: U2.13(B1Y) ; port BF_RADIO.CS
BF_RADIO_MISO: U2.10(B4) ; port BF_RADIO.MISO
BF_RADIO_MOSI: U2.11(B3Y) ; port BF_RADIO.MOSI
BF_RADIO_SCK: U2.12(B2Y) ; port BF_RADIO.SCK
BF_RESET: U4.5(A4Y) ; port BF_MD_LF.RESET
BF_RX: U5.10(B4) ; port BF_PWR_LF.RX
BF_SCK: U1.11(B3Y) ; port BF_MD_LF.SCK
BF_TX: U5.11(B3Y) ; port BF_PWR_LF.TX
SRC_CS_CTRL_0_BF: U3.10(B4) ; port SRC_MD_BF.CS_CTRL_0  [project net SRC_CS_CTRL_0]
SRC_CS_CTRL_1_BF: U3.2(A1) ; port SRC_MD_BF.CS_CTRL_1  [project net SRC_CS_CTRL_1]
SRC_CS_CTRL_2_BF: U3.3(A2) ; port SRC_MD_BF.CS_CTRL_2  [project net SRC_CS_CTRL_2]
SRC_CS_CTRL_3_BF: U3.4(A3) ; port SRC_MD_BF.CS_CTRL_3  [project net SRC_CS_CTRL_3]
SRC_CS_CTRL_4_BF: U4.3(A2) ; port SRC_MD_BF.CS_CTRL_4  [project net SRC_CS_CTRL_4]
SRC_CTRL_EN_BF: U1.2(A1) ; port SRC_MD_BF.CTRL_EN  [project net SRC_CTRL_EN]
SRC_HRBT_BF: U5.3(A2) ; port SRC_PWR_BF.HRBT  [project net SRC_HRBT]
SRC_MISO_BF: U1.5(A4Y) ; port SRC_MD_BF.MISO  [project net SRC_MD_MISO]
SRC_MOSI_BF: U1.3(A2) ; port SRC_MD_BF.MOSI  [project net SRC_MD_MOSI]
SRC_MUX_SEL_0_BF: U4.2(A1) ; port SRC_MD_BF.MUX_SEL_0  [project net SRC_MUX_SEL_0]
SRC_MUX_SEL_1_BF: U4.4(A3) ; port SRC_MD_BF.MUX_SEL_1  [project net SRC_MUX_SEL_1]
SRC_RADIO_CE: U5.2(A1) ; port SRC_RADIO_BF.CE
SRC_RADIO_CS: U2.2(A1) ; port SRC_RADIO_BF.CS
SRC_RADIO_MISO: U2.5(A4Y) ; port SRC_RADIO_BF.MISO
SRC_RADIO_MOSI: U2.4(A3) ; port SRC_RADIO_BF.MOSI
SRC_RADIO_SCK: U2.3(A2) ; port SRC_RADIO_BF.SCK
SRC_RESET_BF: U4.10(B4) ; port SRC_MD_BF.RESET  [project net SRC_MD_RESET]
SRC_RX_BF: U5.5(A4Y) ; port SRC_PWR_BF.RX  [project net SRC_RX]
SRC_SCK_BF: U1.4(A3) ; port SRC_MD_BF.SCK  [project net SRC_MD_SCK]
SRC_TX_BF: U5.4(A3) ; port SRC_PWR_BF.TX  [project net SRC_TX]
NetR4_2: R4.2(R2) R7.1(R1) U1.8(OE)
NetR8_2: R8.2(R2) R9.1(R1) U2.8(OE)
NetR10_2: R10.2(R2) R11.1(R1) U3.8(OE)
NetR12_2: R12.2(R2) R13.1(R1) U4.8(OE)
NetR14_2: R14.2(R2) R15.1(R1) U5.8(OE)

Not connected (* = marked no-connect by the designer): U1 6(NC)* 9(NC)*; U2 6(NC)* 9(NC)*; U3 6(NC)* 9(NC)*; U4 6(NC)* 9(NC)*; U5 6(NC)* 9(NC)*

### Notes on the sheet
- Motordriver Signals from Jetson Nano
- Motordriver Signals to Lowpass Filter
- Power Signals from Jetson Nano
- Populate the highside with 0 Ohm Resistor to enable all outputs.
  Populate lowside with 0 Ohm Resistor to put all outputs in high-impedance mode
  NOTE: Only populate one of the OE resistor at a time.
- Power Signals to Lowpass Filter
- Radio Interface from Jetson Nano
- Radio Interface to Radio
- Added RADIO_CE to extra pin
- Kenny Wakaba

### Library data of the parts
C5-C9 C11-C15 = CAP 0.10uF 16V: as C2 on sheet power; Package: 0603/0805; Temperature Coefficient: X5R; Operating Temperature: -55°C ~ 85°C; Value: 0.10uF; Part Number: CAP 0.10uF 16V
R4 R7-R15 = RES 0 JUMPER: as R24 on sheet jumper; Package: 0805; Part Number: RES 0 JUMPER; Tolerance: N/A; Supplier 1: Digi-Key; Supplier Part Number 1: 2019-RK73Z1JTTDCT-ND; Supplier URL 1: https://www.digikey.ca/en/products/detail/koa-speer-electronics-inc/RK73Z1JTTD/9845478
U1-U5 = TXU0304: 4-Bit Fixed Direction Voltage-Level Translator with Schmitt-Trigger Inputs  and 3-State Outputs; Mfr_Name: Texas Instruments; Copyright: Copyright (C) 2022 Ultra Librarian. All rights reserved.; Manufacturer_Part_Number: TXU0304PWR; Digi-Key_Part_Number_1: 296-TXU0304PWRTR-ND; Digi-Key_Part_Number_2: 296-TXU0304PWRCT-ND; Digi-Key_Part_Number_3: 296-TXU0304PWRDKR-ND; RefDes: RefDes; Type: DEV; Part Number: TXU0304; Supplier 1: Digi-Key; Supplier Part Number 1: 296-TXU0304PWRTR-ND; Supplier URL 1: https://www.digikey.ca/en/products/detail/texas-instruments/TXU0304PWR/14641423

## Sheet optocouplers.SchDoc
size A4
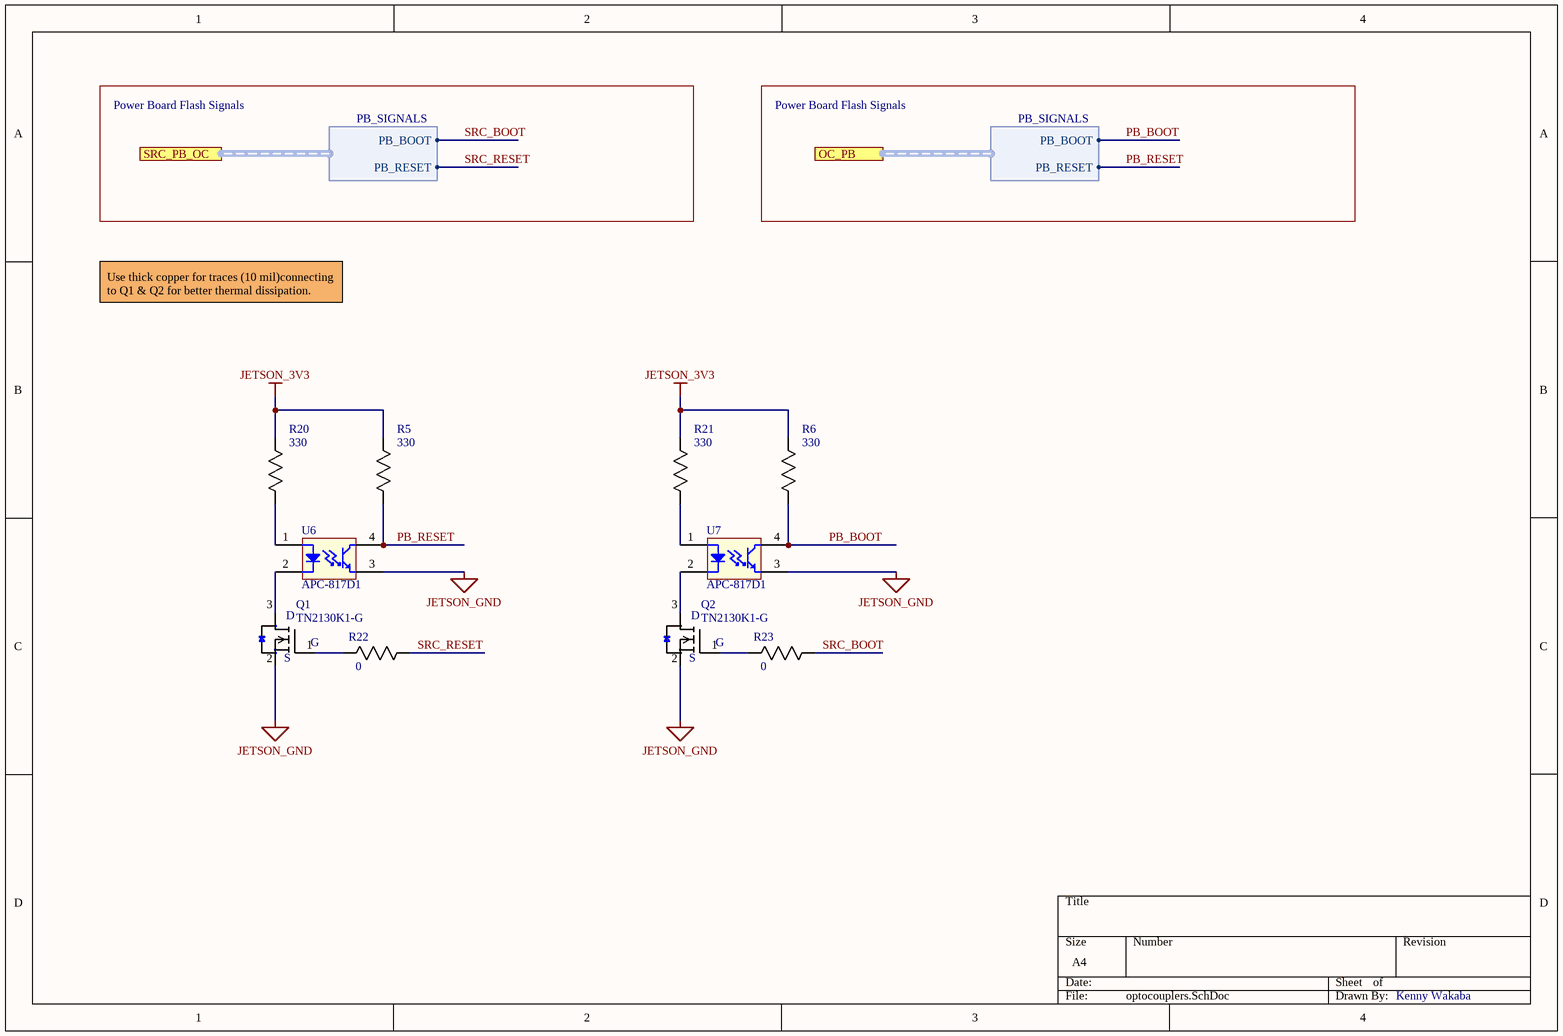
[diagram p7: optocouplers.SchDoc]

### Parts
Q1  TN2130K1-G  [SOT95P237X112-3N]
Q2  TN2130K1-G  [SOT95P237X112-3N]
R5  330  [0603]
R6  330  [0603]
R20  330  [0603]
R21  330  [0603]
R22  0  [0603]
R23  0  [0603]
U6  APC-817D1  [APC-817D1]
U7  APC-817D1  [APC-817D1]

### Ports
OC_PB (harness PB_SIGNALS), SRC_PB_OC (harness PB_SIGNALS)

### Harnesses
PB_SIGNALS: PB_BOOT, PB_RESET

### Nets
JETSON_3V3: R5.2(R2) R6.2(R2) R20.2(R2) R21.2(R2)
JETSON_GND: Q1.2(S) Q2.2(S) U6.3 U7.3
PB_BOOT: R6.1(R1) U7.4 ; port OC_PB.PB_BOOT  [project net BOOT]
PB_RESET: R5.1(R1) U6.4 ; port OC_PB.PB_RESET
SRC_BOOT: R23.1(R1) ; port SRC_PB_OC.PB_BOOT
SRC_RESET: R22.1(R1) ; port SRC_PB_OC.PB_RESET
NetQ1_1: Q1.1(G) R22.2(R2)
NetQ1_3: Q1.3(D) U6.2
NetQ2_1: Q2.1(G) R23.2(R2)
NetQ2_3: Q2.3(D) U7.2
NetR20_1: R20.1(R1) U6.1
NetR21_1: R21.1(R1) U7.1

### Notes on the sheet
- Power Board Flash Signals
- Use thick copper for traces (10 mil)connecting to Q1 & Q2 for better thermal dissipation.
- Kenny Wakaba

### Library data of the parts
Q1 Q2 = MOSFET N-CH TN2130K1-G: N-Channel 300 V 85mA (Tj) 360mW (Tc) Surface Mount TO-236AB (SOT23); Mfr_Name: Microchip; Type: DEV; Copyright: Copyright (C) 2021 Ultra Librarian. All rights reserved.; Manufacturer_Part_Number: TN2130K1-G; Digi-Key_Part_Number_1: TN2130K1-GCT-ND; Digi-Key_Part_Number_2: TN2130K1-GDKR-ND; Digi-Key_Part_Number_3: TN2130K1-GTR-ND; RefDes: RefDes; Supplier 1: Digi-Key; Supplier Part Number 1: TN2130K1-GCT-ND; Part Number: MOSFET N-CH TN2130K1-G; Manufacturer Part Number 1: TN2130K1-G; Supplier URL 1: https://www.digikey.com/en/products/detail/microchip-technology/TN2130K1-G/4902939
R5 R6 R20 R21 = RES 330.0 1/8W - 5%: Default Resistor Symbol; Manufacturer Part Number 1: RMCF0603JT330R; Power (Watts): 0.125W; Tolerance: 5%; Package: 0805; Value: 330; Part Number: RES 330.0 1/8W - 5%; Supplier 1: Digi-Key; Supplier Part Number 1: RMCF0603JT330RCT-ND; Supplier URL 1: https://www.digikey.ca/en/products/detail/stackpole-electronics-inc/RMCF0603JT330R/1757998
R22 R23 = RES 0 JUMPER 0603: Default Resistor Symbol; Power (Watts): 0.125W; Package: 0805; Tolerance: N/A; Value: 0; Part Number: RES 0 JUMPER 0603
U6 U7 = APC-817D1: DIP4, DC Input, Optocoupler; Part Number: APC-817D1; Supplier 1: Digi-Key; Supplier Part Number 1: 2007-APC-817D1-SLCT-ND; Supplier URL 1: https://www.digikey.ca/en/products/detail/american-bright-optoelectronics-corporation/APC-817D1-SL/16273156

## Nets that join several sheets
JETSON_3V3: jetson-nano (C4.2 J5.01 J5.17), radio (J1.2), motor-driver (J2.14 J2.15), power (J3.5 R1.1 R2.1), buffer (25 pins), optocouplers (R5.2 R6.2 R20.2 R21.2)
JETSON_GND: ui-pcb (TP13.1 TP19.1), jetson-nano (10 pins), radio (J1.1), motor-driver (J2.13), power (5 pins), buffer (20 pins), optocouplers (Q1.2 Q2.2 U6.3 U7.3)
BF_CS_CTRL_0: jumper (R27.2), buffer (U3.5)
BF_CS_CTRL_1: jumper (R28.2), buffer (U3.13)
BF_CS_CTRL_2: jumper (R29.2), buffer (U3.12)
BF_CS_CTRL_3: jumper (R30.2), buffer (U3.11)
BF_CS_CTRL_4: jumper (R31.2), buffer (U4.12)
BF_CTRL_EN: jumper (R37.2), buffer (U1.13)
BF_HRBT: jumper (R38.2), buffer (U5.12)
BF_MISO: jumper (R26.2), buffer (U1.10)
BF_MOSI: jumper (R25.2), buffer (U1.12)
BF_MUX_SEL_0: jumper (R32.2), buffer (U4.13)
BF_MUX_SEL_1: jumper (R33.2), buffer (U4.11)
BF_RADIO_CE: radio (J1.3), buffer (U5.13)
BF_RADIO_CS: radio (J1.4), buffer (U2.13)
BF_RADIO_MISO: radio (J1.7), buffer (U2.10)
BF_RADIO_MOSI: radio (J1.6), buffer (U2.11)
BF_RADIO_SCK: radio (J1.5), buffer (U2.12)
BF_RESET: jumper (R35.2), buffer (U4.5)
BF_RX: jumper (R34.2), buffer (U5.10)
BF_SCK: jumper (R24.2), buffer (U1.11)
BF_TX: jumper (R36.2), buffer (U5.11)
BOOT: power (5 pins), optocouplers (R6.1 U7.4)
CS_CTRL_0: jumper (R27.1), motor-driver (J2.2 TP2.1)
CS_CTRL_1: jumper (R28.1), motor-driver (J2.3 TP3.1)
CS_CTRL_2: jumper (R29.1), motor-driver (J2.4 TP4.1)
CS_CTRL_3: jumper (R30.1), motor-driver (J2.5 TP5.1)
CS_CTRL_4: jumper (R31.1), motor-driver (J2.6 TP6.1)
CTRL_EN: jumper (R37.1), motor-driver (J2.11 TP11.1)
HRBT: jumper (R38.1), power (J3.4 TP16.1)
LF_MISO_SRC: jumper (R26.1), motor-driver (J2.9 TP9.1)
LF_MOSI_DST: jumper (R25.1), motor-driver (J2.10 TP10.1)
LF_MUX_SEL_0_DST: jumper (R32.1), motor-driver (J2.1 TP1.1)
LF_MUX_SEL_1_DST: jumper (R33.1), motor-driver (J2.7 TP7.1)
LF_RST_DST: jumper (R35.1), motor-driver (J2.12 TP12.1)
LF_RX_PWR: jumper (R34.1), power (J3.2 TP14.1)
LF_SCK_DST: jumper (R24.1), motor-driver (J2.8 TP8.1)
LF_TX_PWR: jumper (R36.1), power (J3.3 TP15.1)
PB_RESET: power (5 pins), optocouplers (R5.1 U6.4)
SRC_BOOT: jetson-nano (J5.11), optocouplers (R23.1)
SRC_CS_CTRL_0: jetson-nano (J5.24), buffer (U3.10)
SRC_CS_CTRL_1: jetson-nano (J5.26), buffer (U3.2)
SRC_CS_CTRL_2: jetson-nano (J5.29), buffer (U3.3)
SRC_CS_CTRL_3: jetson-nano (J5.31), buffer (U3.4)
SRC_CS_CTRL_4: jetson-nano (J5.33), buffer (U4.3)
SRC_CTRL_EN: jetson-nano (J5.15), buffer (U1.2)
SRC_HRBT: jetson-nano (J5.07), buffer (U5.3)
SRC_MD_MISO: jetson-nano (J5.21), buffer (U1.5)
SRC_MD_MOSI: jetson-nano (J5.19), buffer (U1.3)
SRC_MD_RESET: jetson-nano (J5.32), buffer (U4.10)
SRC_MD_SCK: jetson-nano (J5.23), buffer (U1.4)
SRC_MUX_SEL_0: jetson-nano (J5.36), buffer (U4.2)
SRC_MUX_SEL_1: jetson-nano (J5.35), buffer (U4.4)
SRC_RADIO_CE: jetson-nano (J5.38), buffer (U5.2)
SRC_RADIO_CS: jetson-nano (J5.16), buffer (U2.2)
SRC_RADIO_MISO: jetson-nano (J5.22), buffer (U2.5)
SRC_RADIO_MOSI: jetson-nano (J5.37), buffer (U2.4)
SRC_RADIO_SCK: jetson-nano (J5.13), buffer (U2.3)
SRC_RESET: jetson-nano (J5.12), optocouplers (R22.1)
SRC_RX: jetson-nano (J5.10), buffer (U5.5)
SRC_TX: jetson-nano (J5.08), buffer (U5.4)

## Assembly variants
No FL: all parts fitted
No FL_PD_R: not fitted R7 R9 R11 R13 R15 R17 R18 R19 TP1 TP2 TP3 TP4 TP5 TP6 TP7 TP8 TP9 TP10 TP11 TP12 TP13 TP14 TP15 TP16 TP17 TP18